# Altium schematic sheet FPGA_Banks_Anti_Alias.SchDoc
size A
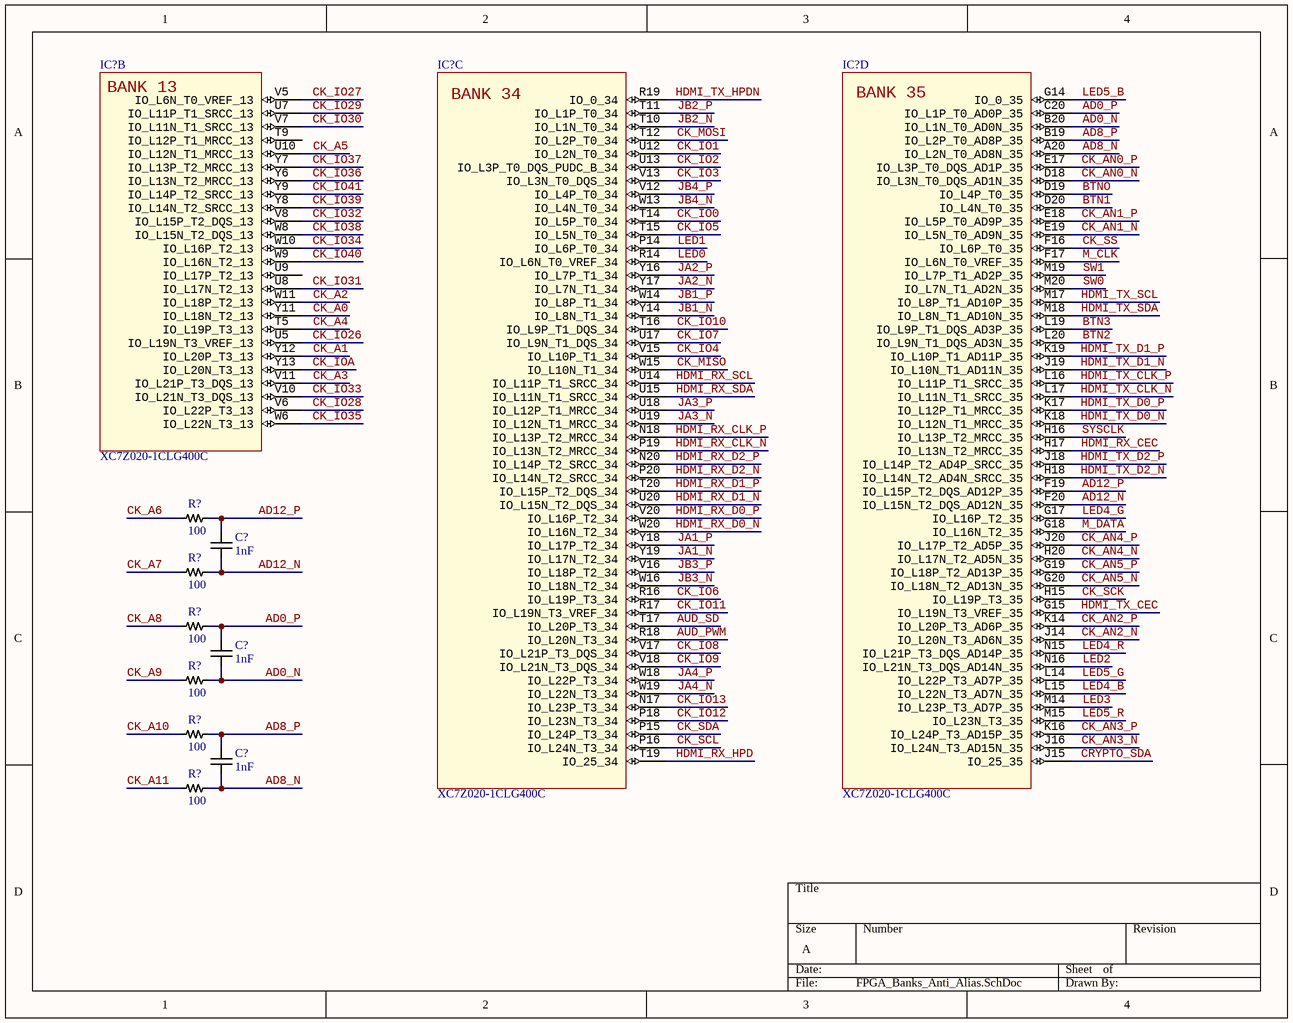
[diagram p0: FPGA_Banks_Anti_Alias.SchDoc]

## Parts
(Parts that share a designator on the sheet are numbered #1, #2 ... from top to bottom, then left to right.)
C?#1  1nF  [CAP0402]
C?#2  1nF  [CAP0402]
C?#3  1nF  [CAP0402]
IC?#1  XC7Z020-1CLG400C  [BGA400]  (part B of 9)
IC?#2  XC7Z020-1CLG400C  [BGA400]  (part C of 9)
IC?#3  XC7Z020-1CLG400C  [BGA400]  (part D of 9)
R?#1  100  [RES0402]
R?#2  100  [RES0402]
R?#3  100  [RES0402]
R?#4  100  [RES0402]
R?#5  100  [RES0402]
R?#6  100  [RES0402]

## Nets
AD0_N: C?#2.2 IC?#3.B20(IO_L1N_T0_AD0N_35) R?#4.2
AD0_P: C?#2.1 IC?#3.C20(IO_L1P_T0_AD0P_35) R?#3.2
AD8_N: C?#3.2 IC?#3.A20(IO_L2N_T0_AD8N_35) R?#6.2
AD8_P: C?#3.1 IC?#3.B19(IO_L2P_T0_AD8P_35) R?#5.2
AD12_N: C?#1.2 IC?#3.F20(IO_L15N_T2_DQS_AD12N_35) R?#2.2
AD12_P: C?#1.1 IC?#3.F19(IO_L15P_T2_DQS_AD12P_35) R?#1.2
AUD_PWM: IC?#2.R18(IO_L20N_T3_34)
AUD_SD: IC?#2.T17(IO_L20P_T3_34)
BTN1: IC?#3.D20(IO_L4N_T0_35)
BTN2: IC?#3.L20(IO_L9N_T1_DQS_AD3N_35)
BTN3: IC?#3.L19(IO_L9P_T1_DQS_AD3P_35)
BTNO: IC?#3.D19(IO_L4P_T0_35)
CK_A0: IC?#1.Y11(IO_L18N_T2_13)
CK_A1: IC?#1.Y12(IO_L20P_T3_13)
CK_A2: IC?#1.W11(IO_L18P_T2_13)
CK_A3: IC?#1.V11(IO_L21P_T3_DQS_13)
CK_A4: IC?#1.T5(IO_L19P_T3_13)
CK_A5: IC?#1.U10(IO_L12N_T1_MRCC_13)
CK_A6: R?#1.1
CK_A7: R?#2.1
CK_A8: R?#3.1
CK_A9: R?#4.1
CK_A10: R?#5.1
CK_A11: R?#6.1
CK_AN0_N: IC?#3.D18(IO_L3N_T0_DQS_AD1N_35)
CK_AN0_P: IC?#3.E17(IO_L3P_T0_DQS_AD1P_35)
CK_AN1_N: IC?#3.E19(IO_L5N_T0_AD9N_35)
CK_AN1_P: IC?#3.E18(IO_L5P_T0_AD9P_35)
CK_AN2_N: IC?#3.J14(IO_L20N_T3_AD6N_35)
CK_AN2_P: IC?#3.K14(IO_L20P_T3_AD6P_35)
CK_AN3_N: IC?#3.J16(IO_L24N_T3_AD15N_35)
CK_AN3_P: IC?#3.K16(IO_L24P_T3_AD15P_35)
CK_AN4_N: IC?#3.H20(IO_L17N_T2_AD5N_35)
CK_AN4_P: IC?#3.J20(IO_L17P_T2_AD5P_35)
CK_AN5_N: IC?#3.G20(IO_L18N_T2_AD13N_35)
CK_AN5_P: IC?#3.G19(IO_L18P_T2_AD13P_35)
CK_IO0: IC?#2.T14(IO_L5P_T0_34)
CK_IO1: IC?#2.U12(IO_L2N_T0_34)
CK_IO2: IC?#2.U13(IO_L3P_T0_DQS_PUDC_B_34)
CK_IO3: IC?#2.V13(IO_L3N_T0_DQS_34)
CK_IO4: IC?#2.V15(IO_L10P_T1_34)
CK_IO5: IC?#2.T15(IO_L5N_T0_34)
CK_IO6: IC?#2.R16(IO_L19P_T3_34)
CK_IO7: IC?#2.U17(IO_L9N_T1_DQS_34)
CK_IO8: IC?#2.V17(IO_L21P_T3_DQS_34)
CK_IO9: IC?#2.V18(IO_L21N_T3_DQS_34)
CK_IO10: IC?#2.T16(IO_L9P_T1_DQS_34)
CK_IO11: IC?#2.R17(IO_L19N_T3_VREF_34)
CK_IO12: IC?#2.P18(IO_L23N_T3_34)
CK_IO13: IC?#2.N17(IO_L23P_T3_34)
CK_IO26: IC?#1.U5(IO_L19N_T3_VREF_13)
CK_IO27: IC?#1.V5(IO_L6N_T0_VREF_13)
CK_IO28: IC?#1.V6(IO_L22P_T3_13)
CK_IO29: IC?#1.U7(IO_L11P_T1_SRCC_13)
CK_IO30: IC?#1.V7(IO_L11N_T1_SRCC_13)
CK_IO31: IC?#1.U8(IO_L17N_T2_13)
CK_IO32: IC?#1.V8(IO_L15P_T2_DQS_13)
CK_IO33: IC?#1.V10(IO_L21N_T3_DQS_13)
CK_IO34: IC?#1.W10(IO_L16P_T2_13)
CK_IO35: IC?#1.W6(IO_L22N_T3_13)
CK_IO36: IC?#1.Y6(IO_L13N_T2_MRCC_13)
CK_IO37: IC?#1.Y7(IO_L13P_T2_MRCC_13)
CK_IO38: IC?#1.W8(IO_L15N_T2_DQS_13)
CK_IO39: IC?#1.Y8(IO_L14N_T2_SRCC_13)
CK_IO40: IC?#1.W9(IO_L16N_T2_13)
CK_IO41: IC?#1.Y9(IO_L14P_T2_SRCC_13)
CK_IOA: IC?#1.Y13(IO_L20N_T3_13)
CK_MISO: IC?#2.W15(IO_L10N_T1_34)
CK_MOSI: IC?#2.T12(IO_L2P_T0_34)
CK_SCK: IC?#3.H15(IO_L19P_T3_35)
CK_SCL: IC?#2.P16(IO_L24N_T3_34)
CK_SDA: IC?#2.P15(IO_L24P_T3_34)
CK_SS: IC?#3.F16(IO_L6P_T0_35)
CRYPTO_SDA: IC?#3.J15(IO_25_35)
HDMI_RX_CEC: IC?#3.H17(IO_L13N_T2_MRCC_35)
HDMI_RX_CLK_N: IC?#2.P19(IO_L13N_T2_MRCC_34)
HDMI_RX_CLK_P: IC?#2.N18(IO_L13P_T2_MRCC_34)
HDMI_RX_D0_N: IC?#2.W20(IO_L16N_T2_34)
HDMI_RX_D0_P: IC?#2.V20(IO_L16P_T2_34)
HDMI_RX_D1_N: IC?#2.U20(IO_L15N_T2_DQS_34)
HDMI_RX_D1_P: IC?#2.T20(IO_L15P_T2_DQS_34)
HDMI_RX_D2_N: IC?#2.P20(IO_L14N_T2_SRCC_34)
HDMI_RX_D2_P: IC?#2.N20(IO_L14P_T2_SRCC_34)
HDMI_RX_HPD: IC?#2.T19(IO_25_34)
HDMI_RX_SCL: IC?#2.U14(IO_L11P_T1_SRCC_34)
HDMI_RX_SDA: IC?#2.U15(IO_L11N_T1_SRCC_34)
HDMI_TX_CEC: IC?#3.G15(IO_L19N_T3_VREF_35)
HDMI_TX_CLK_N: IC?#3.L17(IO_L11N_T1_SRCC_35)
HDMI_TX_CLK_P: IC?#3.L16(IO_L11P_T1_SRCC_35)
HDMI_TX_D0_N: IC?#3.K18(IO_L12N_T1_MRCC_35)
HDMI_TX_D0_P: IC?#3.K17(IO_L12P_T1_MRCC_35)
HDMI_TX_D1_N: IC?#3.J19(IO_L10N_T1_AD11N_35)
HDMI_TX_D1_P: IC?#3.K19(IO_L10P_T1_AD11P_35)
HDMI_TX_D2_N: IC?#3.H18(IO_L14N_T2_AD4N_SRCC_35)
HDMI_TX_D2_P: IC?#3.J18(IO_L14P_T2_AD4P_SRCC_35)
HDMI_TX_HPDN: IC?#2.R19(IO_0_34)
HDMI_TX_SCL: IC?#3.M17(IO_L8P_T1_AD10P_35)
HDMI_TX_SDA: IC?#3.M18(IO_L8N_T1_AD10N_35)
JA1_N: IC?#2.Y19(IO_L17N_T2_34)
JA1_P: IC?#2.Y18(IO_L17P_T2_34)
JA2_N: IC?#2.Y17(IO_L7N_T1_34)
JA2_P: IC?#2.Y16(IO_L7P_T1_34)
JA3_N: IC?#2.U19(IO_L12N_T1_MRCC_34)
JA3_P: IC?#2.U18(IO_L12P_T1_MRCC_34)
JA4_N: IC?#2.W19(IO_L22N_T3_34)
JA4_P: IC?#2.W18(IO_L22P_T3_34)
JB1_N: IC?#2.Y14(IO_L8N_T1_34)
JB1_P: IC?#2.W14(IO_L8P_T1_34)
JB2_N: IC?#2.T10(IO_L1N_T0_34)
JB2_P: IC?#2.T11(IO_L1P_T0_34)
JB3_N: IC?#2.W16(IO_L18N_T2_34)
JB3_P: IC?#2.V16(IO_L18P_T2_34)
JB4_N: IC?#2.W13(IO_L4N_T0_34)
JB4_P: IC?#2.V12(IO_L4P_T0_34)
LED0: IC?#2.R14(IO_L6N_T0_VREF_34)
LED1: IC?#2.P14(IO_L6P_T0_34)
LED2: IC?#3.N16(IO_L21N_T3_DQS_AD14N_35)
LED3: IC?#3.M14(IO_L23P_T3_AD7P_35)
LED4_B: IC?#3.L15(IO_L22N_T3_AD7N_35)
LED4_G: IC?#3.G17(IO_L16P_T2_35)
LED4_R: IC?#3.N15(IO_L21P_T3_DQS_AD14P_35)
LED5_B: IC?#3.G14(IO_0_35)
LED5_G: IC?#3.L14(IO_L22P_T3_AD7P_35)
LED5_R: IC?#3.M15(IO_L23N_T3_35)
M_CLK: IC?#3.F17(IO_L6N_T0_VREF_35)
M_DATA: IC?#3.G18(IO_L16N_T2_35)
SW0: IC?#3.M20(IO_L7N_T1_AD2N_35)
SW1: IC?#3.M19(IO_L7P_T1_AD2P_35)
SYSCLK: IC?#3.H16(IO_L13P_T2_MRCC_35)

Not connected (* = marked no-connect by the designer): IC?#1 T9(IO_L12P_T1_MRCC_13) U9(IO_L17P_T2_13)

## Notes on the sheet
- (in symbol XC7Z020-1CLG400C, part B) BANK 13
- (in symbol XC7Z020-1CLG400C, part C) BANK 34
- (in symbol XC7Z020-1CLG400C, part D) BANK 35

## Library data of the parts
C?#1-C?#3 = GCM155R71H102KA37D: MLCC 1nF 0402 SMD; Manufacturer: Murata; Voltage Rating: 50V; Tolerance: 10%; Dielectric: X7R; Supplier 1: Digi-Key; Manufacturer Part Number: GCM155R71H102KA37D; Stock 1: 18060146; Pricing 1: 1=0.10000, 10=0.03900, 100=0.01720, 500=0.01228, 1000=0.00965, 2500=0.00878, 5000=0.00807 (USD); RoHS: Yes; Mount: Surface Mount; Case/Package: 0402; Case Code (Metric): 1005; Case Code (Imperial): 0402; Min Operating Temperature: -55°C; Max Operating Temperature: 125°C; Package Quantity: 1; Capacitance: 1nF; Packaging: Tape and Reel; Voltage Rating (DC): 50V; Termination: SMD/SMT; Voltage: 50V; Length: 1mm; Height: 0.5mm; Width: 0.02inch; Thickness: 0.022inch; Depth: 0.5mm; Ratings: AEC-Q200; Radiation Hardening: No; REACH SVHC: No SVHC; Lead Free: Lead Free; ComponentLink1URL: https://datasheet.ciiva.com/130/product-130720.pdf?src-supplier=Digi-Key; ComponentLink1Description: https://datasheet.ciiva.com/130/product-130720.pdf?src-supplier=Digi-Key; ComponentLink2URL: https://datasheet.ciiva.com/18183/getdatasheetpartid-140970-18183520.pdf?src-supplier=Verical; ComponentLink2Description: https://datasheet.ciiva.com/18183/getdatasheetpartid-140970-18183520.pdf?src-supplier=Verical; ComponentLink3URL: https://datasheet.ciiva.com/3778/3103gcm155r71h102ka3723-3778878.pdf?src-supplier=Arrow; ComponentLink3Description: https://datasheet.ciiva.com/3778/3103gcm155r71h102ka3723-3778878.pdf?src-supplier=Arrow; ComponentLink4URL: https://datasheet.ciiva.com/11786/0900766b80ef92d0-11786143.pdf?src-supplier=RSComponents; ComponentLink4Description: https://datasheet.ciiva.com/11786/0900766b80ef92d0-11786143.pdf?src-supplier=RSComponents; ComponentLink5URL: https://datasheet.ciiva.com/16213/product-16213384.pdf?src-supplier=Future+Electronics; ComponentLink5Description: https://datasheet.ciiva.com/16213/product-16213384.pdf?src-supplier=Future+Electronics
IC?#1-IC?#3 = XC7Z020-1CLG400C: Zynq-7000 SoC.; ComponentLink1Description: Digi-Key; ComponentLink1URL: https://www.digikey.com/product-detail/en/xilinx-inc/XC7Z020-1CLG400C/122-1851-ND/3925758?utm_adgroup=Integrated Circuits&slid=&gclid=Cj0KCQjwn_LrBRD4ARIsAFEQFKtYXIOPieaS_xsLL2AvFALkVw3M5siD0KQOWM0owpA_yiQuHKATBqcaAuQ6EALw_wcB
R?#1-R?#6 = RC0402FR-07100RL: Resistor 100Ohm 0402 SMD; Manufacturer: Yageo; Power Rating: 62.5mW; Tolerance: 1%; Voltage Rating: 50V; Resistance: 100R; Temperature Coefficient: 100ppm/°C; Supplier 1: Digi-Key; Manufacturer Part Number: RC0402FR-07100RL; Stock 1: 46531178; Pricing 1: 1=0.10000, 10=0.01600, 100=0.00670, 1000=0.00301, 2500=0.00261, 5000=0.00215 (USD); RoHS: Yes; Case/Package: 0402; Number of Pins: 2; Case Code (Imperial): 0402; Case Code (Metric): 1005; Min Operating Temperature: -55°C; Max Operating Temperature: 155°C; Packaging: Tape and Reel; Termination: SMD/SMT; Composition: Thick Film; Military Standard: Not; Voltage Rating (DC): 50V; Length: 1mm; Height: 0.32mm; Depth: 0.5mm; Width: 0.5mm; REACH SVHC: No SVHC; Lead Free: Lead Free; ComponentLink1URL: https://datasheet.ciiva.com/7849/1784430-7849810.pdf?src-supplier=Element14; ComponentLink1Description: https://datasheet.ciiva.com/7849/1784430-7849810.pdf?src-supplier=Element14; ComponentLink2URL: https://datasheet.ciiva.com/11808/0900766b80c66297-11808765.pdf?src-supplier=RSComponents; ComponentLink2Description: https://datasheet.ciiva.com/11808/0900766b80c66297-11808765.pdf?src-supplier=RSComponents; ComponentLink3URL: https://datasheet.ciiva.com/12667/pyu-rc0402-51-rohs-l-6-r-12667957.pdf?src-supplier=Mouser; ComponentLink3Description: https://datasheet.ciiva.com/12667/pyu-rc0402-51-rohs-l-6-r-12667957.pdf?src-supplier=Mouser; ComponentLink4URL: https://datasheet.ciiva.com/22747/1018594-22747511.pdf?src-supplier=Element14; ComponentLink4Description: https://datasheet.ciiva.com/22747/1018594-22747511.pdf?src-supplier=Element14; ComponentLink5URL: https://datasheet.ciiva.com/28367/1018594-28367226.pdf?src-supplier=Element14; ComponentLink5Description: https://datasheet.ciiva.com/28367/1018594-28367226.pdf?src-supplier=Element14; ComponentLink6URL: https://datasheet.ciiva.com/16740/pyu-rc0402-51-rohs-l-6-r-16740566.pdf?src-supplier=Future+Electronics; ComponentLink6Description: https://datasheet.ciiva.com/16740/pyu-rc0402-51-rohs-l-6-r-16740566.pdf?src-supplier=Future+Electronics; ComponentLink7URL: https://datasheet.ciiva.com/15189/getdatasheetpartid-329466-15189335.pdf?src-supplier=Verical; ComponentLink7Description: https://datasheet.ciiva.com/15189/getdatasheetpartid-329466-15189335.pdf?src-supplier=Verical